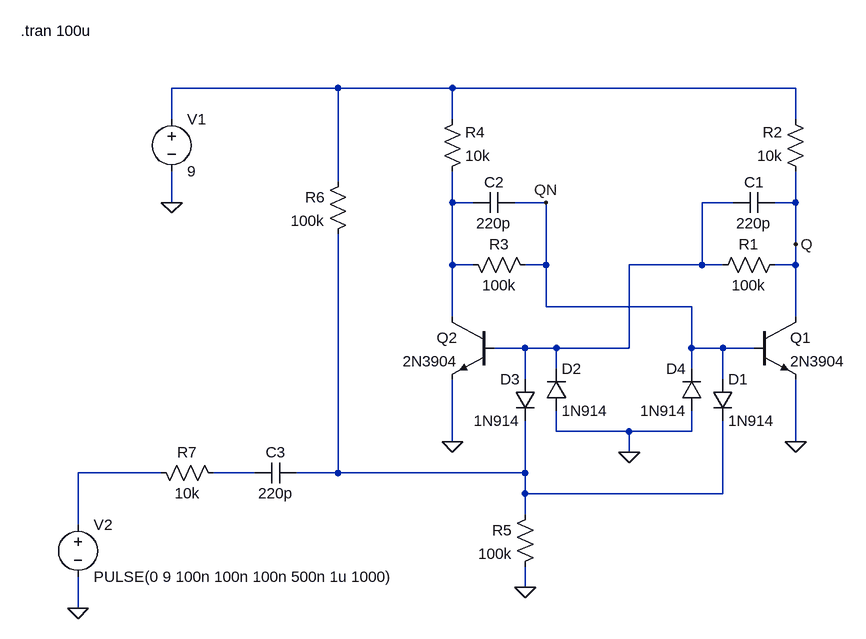
[diagram p0: schematic Draft1.asc]
Draft1.asc, the LTspice schematic file:
Version 4
SHEET 1 880 680
WIRE -400 -224 -656 -224
WIRE -224 -224 -400 -224
WIRE 304 -224 -224 -224
WIRE -656 -176 -656 -224
WIRE -224 -176 -224 -224
WIRE 304 -176 304 -224
WIRE -400 -80 -400 -224
WIRE -656 -48 -656 -96
WIRE -224 -48 -224 -96
WIRE -192 -48 -224 -48
WIRE -80 -48 -128 -48
WIRE 208 -48 160 -48
WIRE 304 -48 304 -96
WIRE 304 -48 272 -48
WIRE 304 16 304 -48
WIRE -224 48 -224 -48
WIRE -192 48 -224 48
WIRE -80 48 -80 -48
WIRE -80 48 -112 48
WIRE 160 48 160 -48
WIRE 160 48 48 48
WIRE 192 48 160 48
WIRE 304 48 304 16
WIRE 304 48 272 48
WIRE -80 112 -80 48
WIRE 144 112 -80 112
WIRE -224 128 -224 48
WIRE 304 128 304 48
WIRE -112 176 -160 176
WIRE -64 176 -112 176
WIRE 48 176 48 48
WIRE 48 176 -64 176
WIRE 144 176 144 112
WIRE 192 176 144 176
WIRE 240 176 192 176
WIRE -64 208 -64 176
WIRE 144 208 144 176
WIRE -112 224 -112 176
WIRE 192 224 192 176
WIRE -64 304 -64 272
WIRE 48 304 -64 304
WIRE 144 304 144 272
WIRE 144 304 48 304
WIRE -224 320 -224 224
WIRE 304 320 304 224
WIRE 48 336 48 304
WIRE -672 368 -800 368
WIRE -528 368 -592 368
WIRE -400 368 -400 0
WIRE -400 368 -464 368
WIRE -112 368 -112 288
WIRE -112 368 -400 368
WIRE -112 400 -112 368
WIRE 192 400 192 288
WIRE 192 400 -112 400
WIRE -112 432 -112 400
WIRE -800 448 -800 368
WIRE -112 544 -112 512
WIRE -800 576 -800 528
FLAG 304 320 0
FLAG -224 320 0
FLAG 48 336 0
FLAG -112 544 0
FLAG -656 -48 0
FLAG 304 16 Q
FLAG -80 -48 QN
FLAG -800 576 0
SYMBOL npn 240 128 R0
SYMATTR InstName Q1
SYMATTR Value 2N3904
SYMBOL res 288 32 R90
WINDOW 0 0 56 VBottom 2
WINDOW 3 32 56 VTop 2
SYMATTR InstName R1
SYMATTR Value 100k
SYMBOL cap 272 -64 R90
WINDOW 0 0 32 VBottom 2
WINDOW 3 32 32 VTop 2
SYMATTR InstName C1
SYMATTR Value 220p
SYMBOL diode 176 224 R0
SYMATTR InstName D1
SYMATTR Value 1N914
SYMBOL diode -80 272 M180
WINDOW 0 24 64 Left 2
WINDOW 3 24 0 Left 2
SYMATTR InstName D2
SYMATTR Value 1N914
SYMBOL res 320 -80 R180
WINDOW 0 36 76 Left 2
WINDOW 3 36 40 Left 2
SYMATTR InstName R2
SYMATTR Value 10k
SYMBOL npn -160 128 M0
SYMATTR InstName Q2
SYMATTR Value 2N3904
SYMBOL res -208 32 M90
WINDOW 0 0 56 VBottom 2
WINDOW 3 32 56 VTop 2
SYMATTR InstName R3
SYMATTR Value 100k
SYMBOL cap -192 -64 M90
WINDOW 0 0 32 VBottom 2
WINDOW 3 32 32 VTop 2
SYMATTR InstName C2
SYMATTR Value 220p
SYMBOL diode -96 224 M0
SYMATTR InstName D3
SYMATTR Value 1N914
SYMBOL res -240 -80 M180
WINDOW 0 36 76 Left 2
WINDOW 3 36 40 Left 2
SYMATTR InstName R4
SYMATTR Value 10k
SYMBOL diode 160 272 R180
WINDOW 0 24 64 Left 2
WINDOW 3 24 0 Left 2
SYMATTR InstName D4
SYMATTR Value 1N914
SYMBOL res -96 416 M0
SYMATTR InstName R5
SYMATTR Value 100k
SYMBOL res -384 -96 M0
SYMATTR InstName R6
SYMATTR Value 100k
SYMBOL cap -528 352 M90
WINDOW 0 0 32 VBottom 2
WINDOW 3 32 32 VTop 2
SYMATTR InstName C3
SYMATTR Value 220p
SYMBOL res -688 352 M90
WINDOW 0 0 56 VBottom 2
WINDOW 3 32 56 VTop 2
SYMATTR InstName R7
SYMATTR Value 10k
SYMBOL voltage -656 -192 R0
WINDOW 123 0 0 Left 0
WINDOW 39 0 0 Left 0
SYMATTR InstName V1
SYMATTR Value 9
SYMBOL voltage -800 432 R0
WINDOW 123 0 0 Left 0
WINDOW 39 0 0 Left 0
SYMATTR InstName V2
SYMATTR Value PULSE(0 9 100n 100n 100n 500n 1u 1000)
TEXT -888 -312 Left 2 !.tran 100u

The netlist it stands for:
* Draft1.asc
Q1 Q QN 0 0 2N3904
R1 Q N003 100k
C1 Q N003 220p
D1 QN N006 1N914
D2 0 N003 1N914
R2 Q N001 10k
Q2 N002 N003 0 0 2N3904
R3 N002 QN 100k
C2 N002 QN 220p
D3 N003 N006 1N914
R4 N002 N001 10k
D4 0 QN 1N914
R5 N006 0 100k
R6 N001 N006 100k
C3 N005 N006 220p
R7 N004 N005 10k
V1 N001 0 9
V2 N004 0 PULSE(0 9 100n 100n 100n 500n 1u 1000)
.model D D
.lib standard.dio
.model NPN NPN
.model PNP PNP
.lib standard.bjt
.tran 100u
.backanno
.end